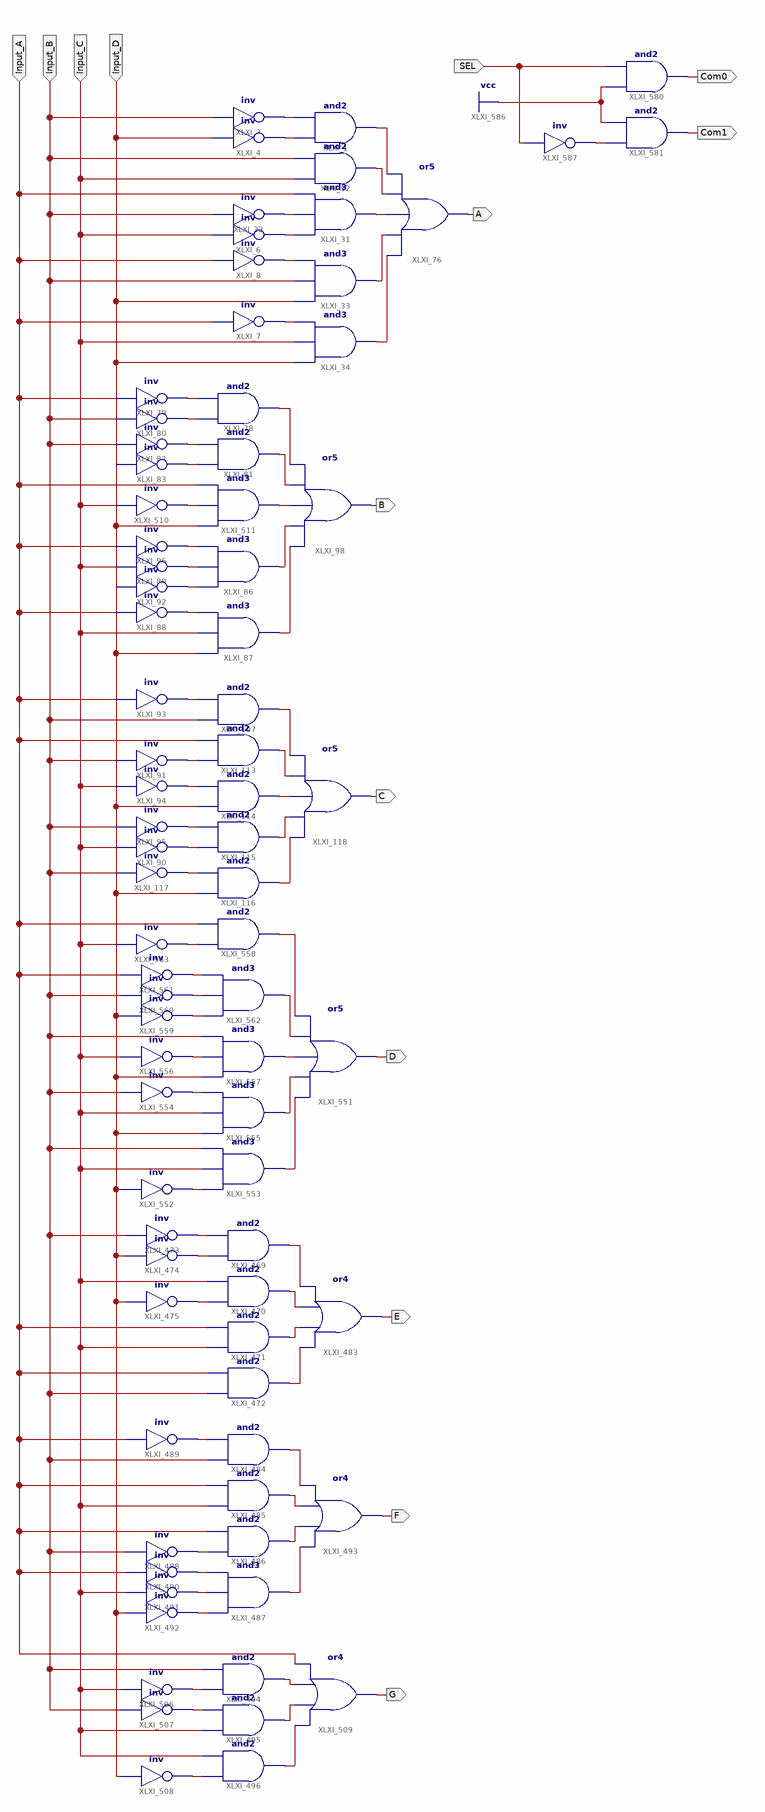
[diagram p0: schematic sheet 1]
// Xilinx ISE schematic BCDto7SegDecoder.sch (spartan6) as structural Verilog: 80 symbols, 14 ports
module BCDto7SegDecoder (
  input  Input_B,
  input  Input_D,
  input  Input_A,
  input  Input_C,
  input  SEL,
  output C,
  output B,
  output E,
  output F,
  output D,
  output A,
  output G,
  output Com0,
  output Com1
);

  wire XLXN_1, XLXN_2, XLXN_19, XLXN_21, XLXN_68, XLXN_69, XLXN_96, XLXN_98, XLXN_99, XLXN_100, XLXN_101,
       XLXN_111, XLXN_112, XLXN_115, XLXN_116, XLXN_123, XLXN_124, XLXN_125, XLXN_130, XLXN_136, XLXN_137,
       XLXN_138, XLXN_139, XLXN_140, XLXN_154, XLXN_158, XLXN_161, XLXN_164, XLXN_165, XLXN_166, XLXN_171,
       XLXN_172, XLXN_173, XLXN_175, XLXN_176, XLXN_652, XLXN_653, XLXN_654, XLXN_669, XLXN_670, XLXN_671,
       XLXN_672, XLXN_682, XLXN_683, XLXN_684, XLXN_685, XLXN_686, XLXN_696, XLXN_697, XLXN_698, XLXN_699,
       XLXN_713, XLXN_714, XLXN_715, XLXN_723, XLXN_724, XLXN_725, XLXN_739, XLXN_903, XLXN_904, XLXN_905,
       XLXN_906, XLXN_907, XLXN_908, XLXN_909, XLXN_910, XLXN_911, XLXN_912, XLXN_913, XLXN_914, XLXN_918;

  and XLXI_107 (XLXN_173, Input_B, XLXN_154);
  not XLXI_93 (XLXN_154, Input_A);
  and XLXI_113 (XLXN_172, XLXN_158, Input_A);
  not XLXI_91 (XLXN_158, Input_B);
  and XLXI_114 (XLXN_171, Input_D, XLXN_161);
  not XLXI_94 (XLXN_161, Input_C);
  and XLXI_115 (XLXN_175, XLXN_166, XLXN_165);
  and XLXI_116 (XLXN_176, Input_D, XLXN_164);
  not XLXI_95 (XLXN_165, Input_B);
  not XLXI_90 (XLXN_166, Input_C);
  not XLXI_117 (XLXN_164, Input_B);
  or XLXI_118 (C, XLXN_176, XLXN_175, XLXN_171, XLXN_172, XLXN_173);
  and XLXI_78 (XLXN_136, XLXN_112, XLXN_111);
  not XLXI_79 (XLXN_111, Input_A);
  not XLXI_80 (XLXN_112, Input_B);
  and XLXI_81 (XLXN_137, XLXN_116, XLXN_115);
  not XLXI_82 (XLXN_115, Input_B);
  not XLXI_83 (XLXN_116, Input_D);
  and XLXI_86 (XLXN_139, XLXN_125, XLXN_124, XLXN_123);
  not XLXI_96 (XLXN_123, Input_A);
  not XLXI_89 (XLXN_124, Input_C);
  not XLXI_92 (XLXN_125, Input_D);
  and XLXI_87 (XLXN_140, Input_D, Input_C, XLXN_130);
  not XLXI_88 (XLXN_130, Input_A);
  or XLXI_98 (B, XLXN_140, XLXN_139, XLXN_138, XLXN_137, XLXN_136);
  not XLXI_510 (XLXN_739, Input_C);
  and XLXI_511 (XLXN_138, Input_D, XLXN_739, Input_A);
  or XLXI_483 (E, XLXN_671, XLXN_670, XLXN_669, XLXN_672);
  not XLXI_475 (XLXN_654, Input_D);
  not XLXI_474 (XLXN_653, Input_D);
  not XLXI_473 (XLXN_652, Input_B);
  and XLXI_472 (XLXN_671, Input_B, Input_A);
  and XLXI_471 (XLXN_670, Input_C, Input_A);
  and XLXI_470 (XLXN_669, XLXN_654, Input_C);
  and XLXI_469 (XLXN_672, XLXN_653, XLXN_652);
  and XLXI_485 (XLXN_696, Input_C, Input_A);
  and XLXI_486 (XLXN_697, XLXN_682, Input_A);
  and XLXI_487 (XLXN_698, XLXN_686, XLXN_685, XLXN_684);
  and XLXI_484 (XLXN_699, Input_B, XLXN_683);
  not XLXI_488 (XLXN_682, Input_B);
  not XLXI_489 (XLXN_683, Input_A);
  not XLXI_490 (XLXN_684, Input_A);
  not XLXI_491 (XLXN_685, Input_C);
  not XLXI_492 (XLXN_686, Input_D);
  or XLXI_493 (F, XLXN_698, XLXN_697, XLXN_696, XLXN_699);
  not XLXI_563 (XLXN_914, Input_C);
  and XLXI_562 (XLXN_904, XLXN_911, XLXN_912, XLXN_913);
  not XLXI_561 (XLXN_913, Input_A);
  not XLXI_560 (XLXN_912, Input_B);
  not XLXI_559 (XLXN_911, Input_D);
  and XLXI_558 (XLXN_907, XLXN_914, Input_A);
  and XLXI_557 (XLXN_905, Input_D, XLXN_910, Input_B);
  not XLXI_556 (XLXN_910, Input_C);
  and XLXI_555 (XLXN_903, Input_D, Input_C, XLXN_909);
  not XLXI_554 (XLXN_909, Input_B);
  and XLXI_553 (XLXN_906, XLXN_908, Input_C, Input_B);
  not XLXI_552 (XLXN_908, Input_D);
  or XLXI_551 (D, XLXN_906, XLXN_903, XLXN_905, XLXN_904, XLXN_907);
  and XLXI_1 (XLXN_96, XLXN_2, XLXN_1);
  not XLXI_3 (XLXN_1, Input_B);
  or XLXI_76 (A, XLXN_101, XLXN_100, XLXN_99, XLXN_98, XLXN_96);
  not XLXI_8 (XLXN_68, Input_A);
  and XLXI_33 (XLXN_100, Input_D, Input_B, XLXN_68);
  and XLXI_31 (XLXN_99, XLXN_21, XLXN_19, Input_A);
  not XLXI_6 (XLXN_21, Input_C);
  not XLXI_32 (XLXN_19, Input_B);
  and XLXI_12 (XLXN_98, Input_C, Input_B);
  not XLXI_4 (XLXN_2, Input_D);
  and XLXI_34 (XLXN_101, Input_D, Input_C, XLXN_69);
  not XLXI_7 (XLXN_69, Input_A);
  not XLXI_508 (XLXN_715, Input_D);
  not XLXI_507 (XLXN_714, Input_B);
  not XLXI_506 (XLXN_713, Input_C);
  and XLXI_496 (XLXN_725, XLXN_715, Input_C);
  and XLXI_495 (XLXN_724, Input_C, XLXN_714);
  and XLXI_494 (XLXN_723, XLXN_713, Input_B);
  or XLXI_509 (G, XLXN_725, XLXN_724, XLXN_723, Input_A);
  and XLXI_580 (Com0, 1'b1, SEL);
  and XLXI_581 (Com1, XLXN_918, 1'b1);
  not XLXI_587 (XLXN_918, SEL);
endmodule
